# Altium project SlimWiFi.PrjPcb
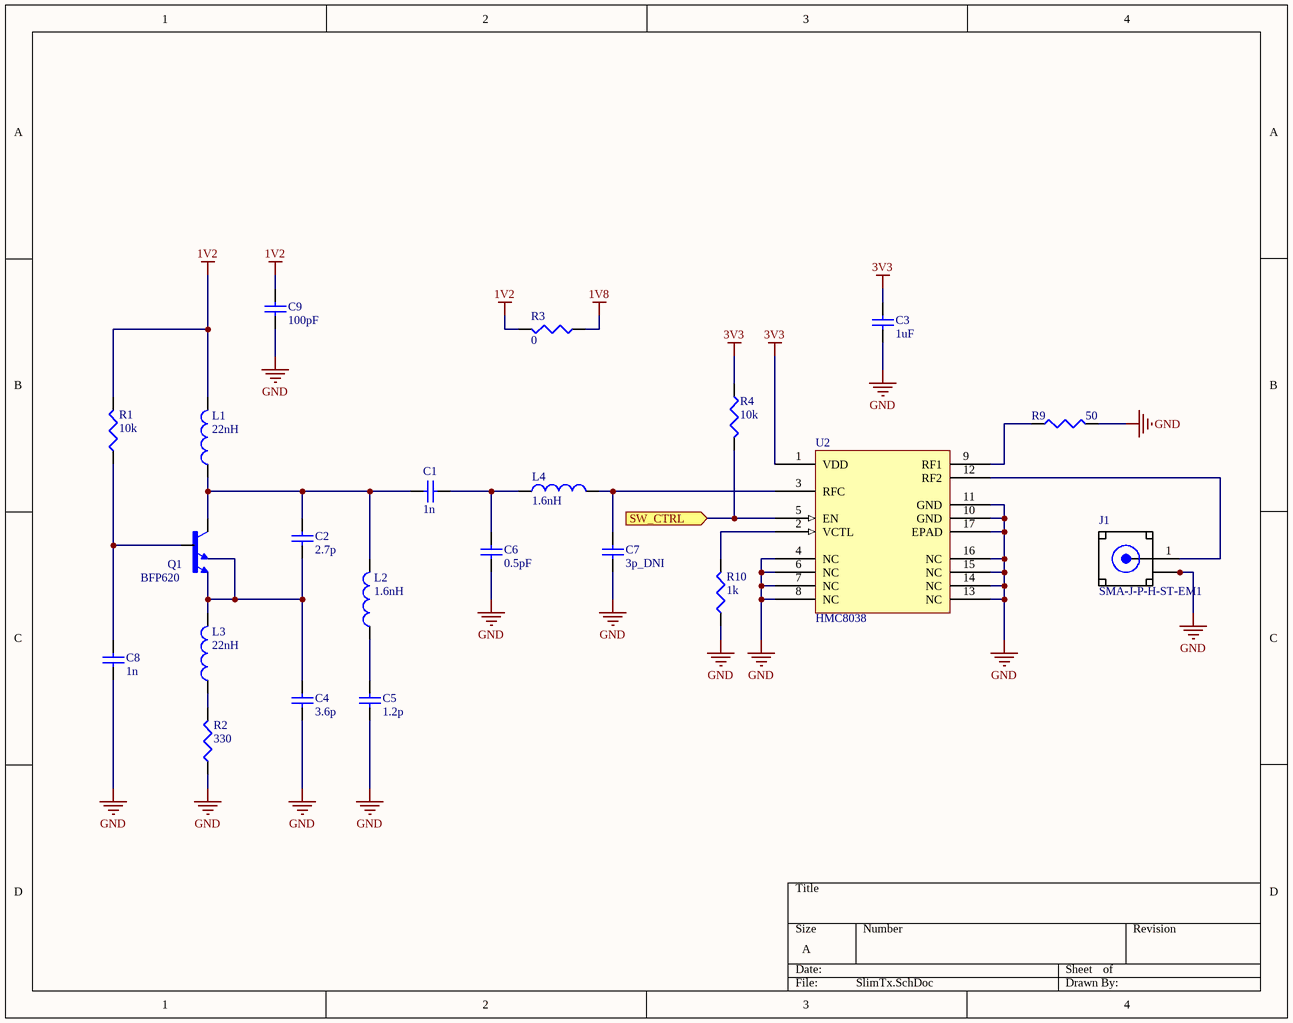
[diagram p0: SlimTx.SchDoc]
2 sheets, 31 parts. Net scope: flat (ports and power ports of the same name join across sheets).
Board file: slimWiFi_B.PcbDoc
Sheets:
  SlimTx.SchDoc
  SlimPower.SchDoc

## Sheet SlimTx.SchDoc
size A; SheetNumber: 1; SheetTotal: 3

### Parts
C1  1n  [SMD-0603]
C2  2.7p  [SMD-0603]
C3  1uF  [SMD-0603]
C4  3.6p  [SMD-0603]
C5  1.2p  [SMD-0603]
C6  0.5pF  [SMD-0603]
C7  3p_DNI  [SMD-0603]
C8  1n  [SMD-0603]
C9  100pF  [SMD-0603]
J1  SMA-J-P-H-ST-EM1  [SMA-J-P-H-ST-EM1]
L1  22nH  [SMD-0603]
L2  1.6nH  [SMD-0603]
L3  22nH  [SMD-0603]
L4  1.6nH  [SMD-0603]
Q1  BFP620  [SOT343]
R1  10k  [SMD-0603]
R2  330  [SMD-0603]
R3  0  [SMD-0603]
R4  10k  [SMD-0603]
R9  50  [SMD-0603]
R10  1k  [SMD-0603]
U2  HMC8038  [PQFN127P600-8N LFCSP-17]

### Ports
SW_CTRL (in)

### Nets
1V2: C9.2 L1.2 R1.2 R3.2
1V8: R3.1
3V3: C3.2 R4.1 U2.1(VDD)
GND: C3.1 C4.1 C5.1 C6.1 C7.1 C8.1 C9.1 J1.2_1(GND) J1.2_2(GND) J1.3_1(GND) J1.3_2(GND) R2.1 R9.2 R10.1 U2.4(NC) U2.6(NC) U2.7(NC) U2.8(NC) U2.10(GND) U2.11(GND) U2.13(NC) U2.14(NC) U2.15(NC) U2.16(NC) U2.17(EPAD)
NetC1_1: C1.1 C6.2 L4.1
NetC1_2: C1.2 C2.2 L1.1 L2.2 Q1.3(C)
NetC2_1: C2.1 C4.2 L3.2 Q1.2(E1) Q1.4(E2)
NetC5_2: C5.2 L2.1
NetC7_2: C7.2 L4.2 U2.3(RFC)
NetC8_2: C8.2 Q1.1(B) R1.1
NetJ1_1: J1.1(SIGNAL) U2.12(RF2)
NetL3_1: L3.1 R2.2
NetP1_4: R4.2 U2.5(EN) ; port SW_CTRL
NetR9_1: R9.1 U2.9(RF1)
NetR10_2: R10.2 U2.2(VCTL)

### Library data of the parts
C1-C9 = CAP0603: Ceramic Capacitor 0603
J1 = SMA-J-P-H-ST-EM1: Connector SMA F 50Ohm Solder ST Edge Mount Gold Over Nickel Tray; MF: Samtec; Price: None; SnapEDA_Link: https://www.snapeda.com/parts/SMA-J-P-H-ST-EM1/Samtec%20Inc./view-part/?ref=snap; MP: SMA-J-P-H-ST-EM1; Package: None; Availability: Unavailable; Value: *
L1-L4 = L0603: Inductor 0603
Q1 = BFP620: Trans RF BJT NPN 2.3V 0.08A 185mW Automotive 4-Pin(3+Tab) SOT-343 T/R; MF: Infineon Technologies; Value: *; SnapEDA_Link: https://www.snapeda.com/parts/BFP620/Infineon+Technologies/view-part/?ref=snap; Check_prices: https://www.snapeda.com/parts/BFP620/Infineon+Technologies/view-part/?ref=eda; Purchase-URL: https://pricing.snapeda.com/search/part/BFP620/?ref=eda; Price: None; Availability: In Stock; Package: None; MP: BFP620
R1-R4 R9 R10 = RES0603: Resistor-0603
U2 = HMC8038: High Isolation, Silicon SPDT, Nonreflective Switch, 0.1 GHz to 6.0 GHz

## Sheet SlimPower.SchDoc
size A; SheetNumber: 3; SheetTotal: 3
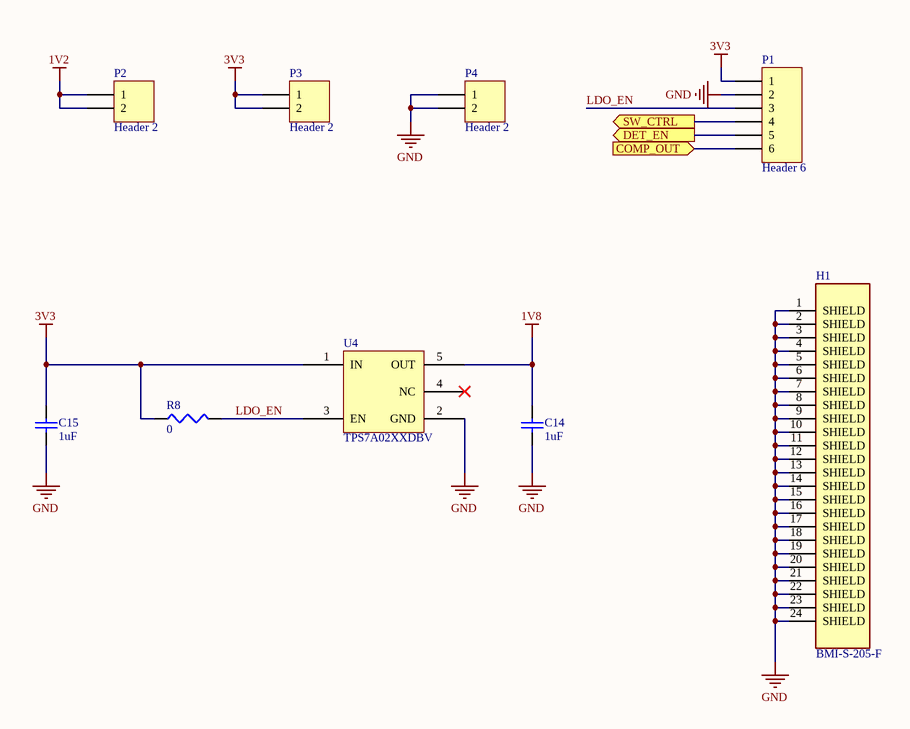
[diagram p1: SlimPower.SchDoc]

### Parts
C14  1uF  [SMD-0603]
C15  1uF  [SMD-0603]
H1  BMI-S-205-F  [LAIRD_BMI-S-205-F]
P1  Header 6  [HDR1X6]
P2  Header 2  [HDR1X2]
P3  Header 2  [HDR1X2]
P4  Header 2  [HDR1X2]
R8  0  [SMD-0603]
U4  TPS7A02XXDBV  [SOT95P280X145-5N]

### Ports
COMP_OUT (in), DET_EN (out), SW_CTRL (out)

### Nets
1V2: P2.1 P2.2
1V8: C14.2 U4.5(OUT)
3V3: C15.2 P1.1 P3.1 P3.2 R8.1 U4.1(IN)
GND: C14.1 C15.1 H1.1(SHIELD) H1.2(SHIELD) H1.3(SHIELD) H1.4(SHIELD) H1.5(SHIELD) H1.6(SHIELD) H1.7(SHIELD) H1.8(SHIELD) H1.9(SHIELD) H1.10(SHIELD) H1.11(SHIELD) H1.12(SHIELD) H1.13(SHIELD) H1.14(SHIELD) H1.15(SHIELD) H1.16(SHIELD) H1.17(SHIELD) H1.18(SHIELD) H1.19(SHIELD) H1.20(SHIELD) H1.21(SHIELD) H1.22(SHIELD) H1.23(SHIELD) H1.24(SHIELD) P1.2 P4.1 P4.2 U4.2(GND)
LDO_EN: P1.3 R8.2 U4.3(EN)
NetP1_4: P1.4 ; port SW_CTRL
NetP1_5: P1.5 ; port DET_EN
NetP1_6: P1.6 ; port COMP_OUT

Not connected (* = marked no-connect by the designer): U4 4(NC)*

### Library data of the parts
C14 C15 = CAP0603: Ceramic Capacitor 0603
H1 = BMI-S-205-F: RF Shield Frame 1.000 _25.40mm_ X 1.500 _38.10mm_ Solder; MF: Laird Technologies; Price: None; SnapEDA_Link: https://www.snapeda.com/parts/BMI-S-205-F/Laird%20Technologies%20EMI/view-part/596236/?ref=snap; Package: TSSOP-14 Laird; Availability: Unavailable; Value: *; MP: BMI-S-205-F
P1 = Header 6: Header, 6-Pin; LatestRevisionDate: 17-Jul-2002; LatestRevisionNote: Re-released for DXP Platform.; Publisher: Altium Limited
P2-P4 = Header 2: Header, 2-Pin; LatestRevisionDate: 17-Jul-2002; LatestRevisionNote: Re-released for DXP Platform.; Publisher: Altium Limited
R8 = RES0603: Resistor-0603
U4 = TPS7A02XXDBV: TPS7A02 Nanopower IQ, 25-nA, 200-mA, Low-Dropout Voltage Regulator With Fast / Transient Response

## Nets that join several sheets
1V2: SlimTx (C9.2 L1.2 R1.2 R3.2), SlimPower (P2.1 P2.2)
1V8: SlimTx (R3.1), SlimPower (C14.2 U4.5)
3V3: SlimTx (C3.2 R4.1 U2.1), SlimPower (6 pins)
GND: SlimTx (25 pins), SlimPower (30 pins)
NetP1_4: SlimTx (R4.2 U2.5), SlimPower (P1.4)